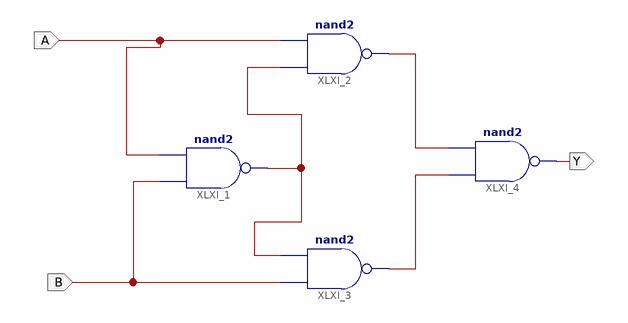
[diagram p0: schematic sheet 1]
// Xilinx ISE schematic schem.sch (spartan3e) as structural Verilog: 4 symbols, 3 ports
module schem (
  input  A,
  input  B,
  output Y
);

  wire XLXN_9, XLXN_12, XLXN_13;

  nand XLXI_1 (XLXN_9, B, A);
  nand XLXI_2 (XLXN_12, XLXN_9, A);
  nand XLXI_3 (XLXN_13, B, XLXN_9);
  nand XLXI_4 (Y, XLXN_13, XLXN_12);
endmodule
